# EasyEDA schematic SCH.json
TITLE: Sheet_1; REV: 1.0; Date: 2024-05-03; Sheet: 1/1; Drawn By: scottchiang7; Company: Your Company
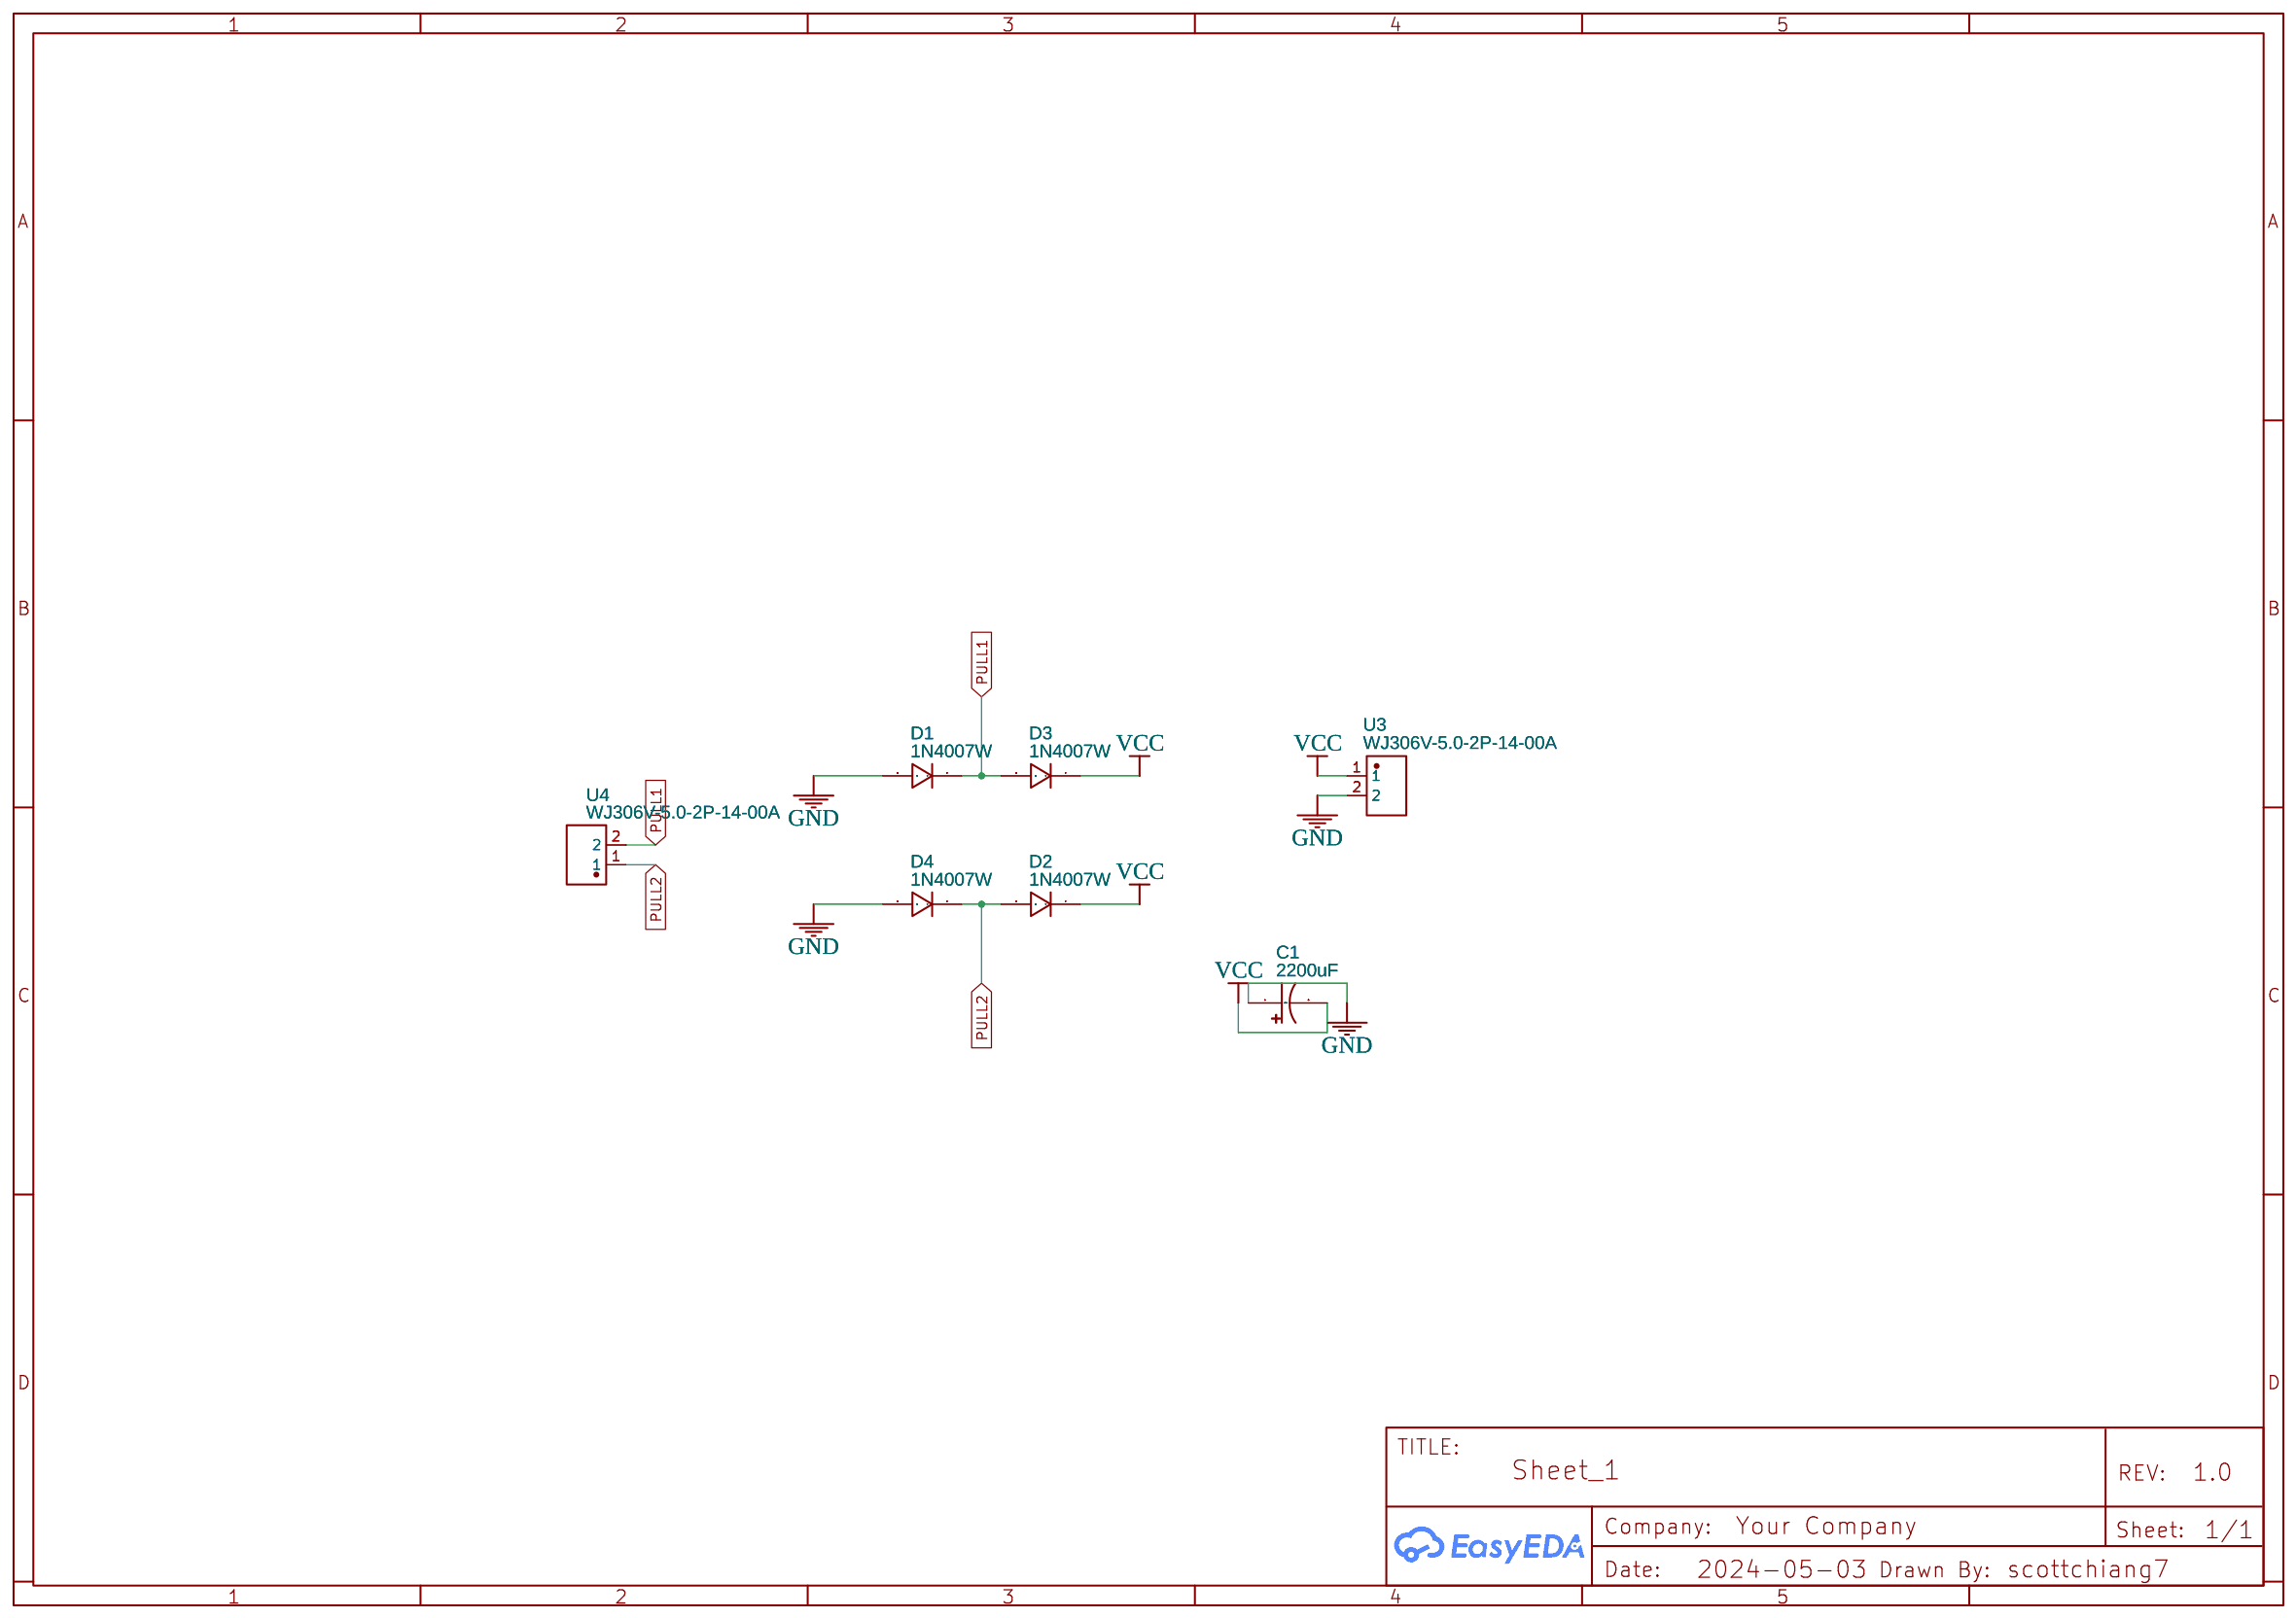
[diagram p0: schematic sheet]

## Parts
C1  2200uF  [CAP-TH_BD12.5-P5.00-D0.6-FD]
D1  1N4007W  [SOD-123_L2.8-W1.8-LS3.7-RD]
D2  1N4007W  [SOD-123_L2.8-W1.8-LS3.7-RD]
D3  1N4007W  [SOD-123_L2.8-W1.8-LS3.7-RD]
D4  1N4007W  [SOD-123_L2.8-W1.8-LS3.7-RD]
U3  WJ306V-5.0-2P-14-00A  [CONN-TH_2P-P5.00_L7.6-W10.0]
U4  WJ306V-5.0-2P-14-00A  [CONN-TH_2P-P5.00_L7.6-W10.0]

## Library data of the parts
C1 = 25YXA2200MEFCCE12.5X25: Contributor: LCSC; Supplier: LCSC; Supplier Part: C365705; Manufacturer: rubycon(红宝石); JLCPCB Part Class: Extended Part
D1-D4 = 1N4007W: Supplier: LCSC; Supplier Part: C328592; Manufacturer: BLUE ROCKET; Contributor: LCEDA_Lib
U3 U4 = WJ306V-5.0-2P-14-00A: Contributor: lcsc; Supplier: LCSC; Supplier Part: C3031443; Manufacturer: KANGNEX(康奈克斯电气); JLCPCB Part Class: Extended Part

## Nets
GND: C1.1 D1.2 D4.2 U3.2
VCC: C1.2 D2.1 D3.1 U3.1
PULL1: D1.1 D3.2 U4.2
PULL2: D2.2 D4.1 U4.1
